# EAGLE schematic core (EAGLE 9.2.2)
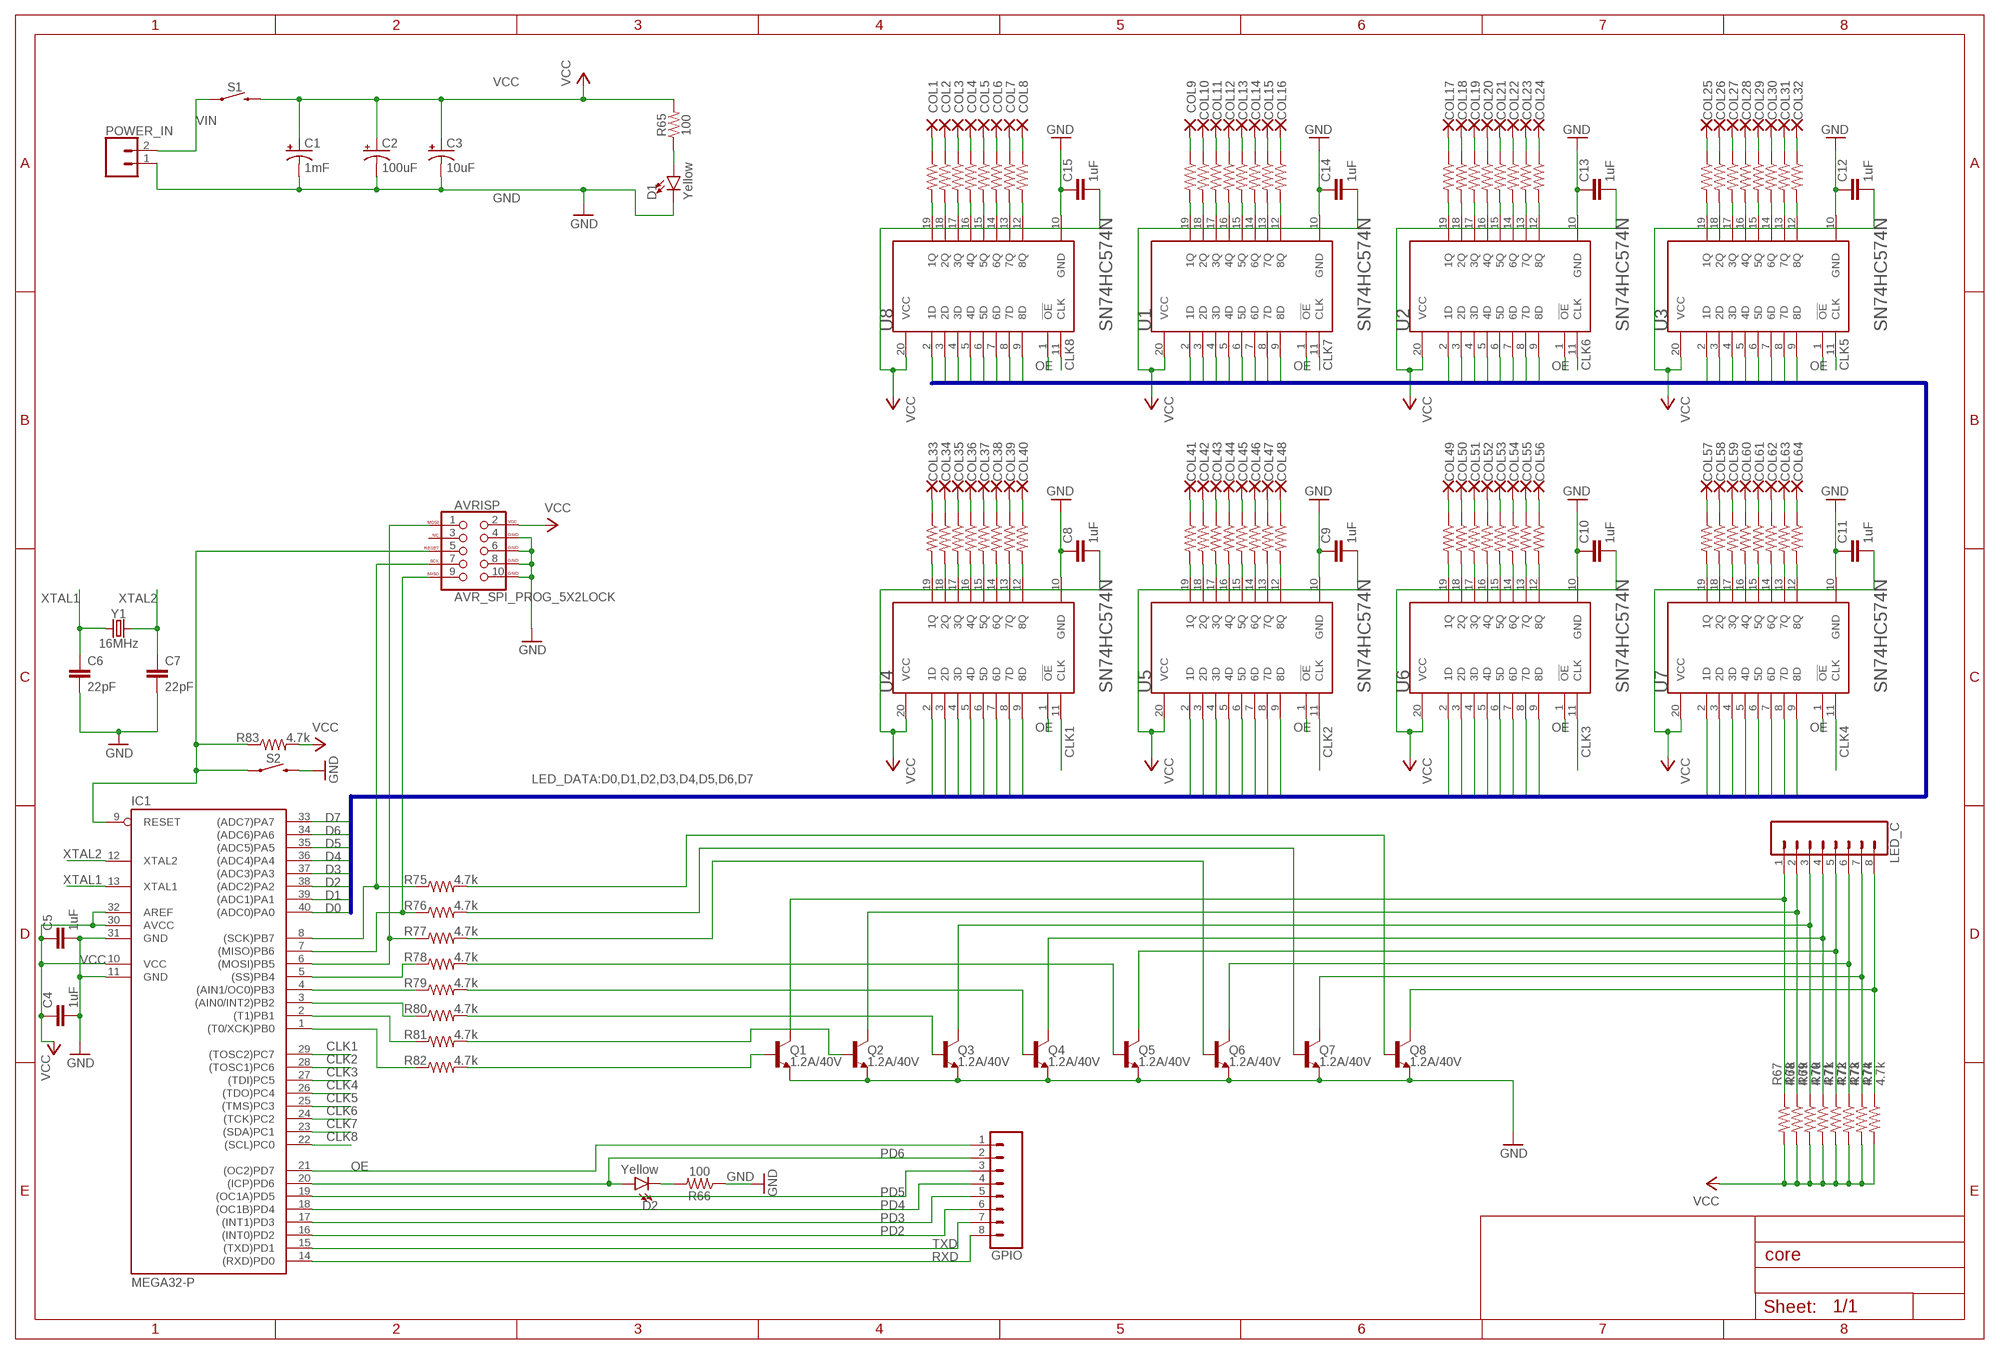
[diagram p0: schematic, sheet 1]

## Parts
AVRISP  AVR_SPI_PROG_5X2LOCK  [2X5-SHROUDED_LOCK]
C1  1mF  1000UF-RADIAL-5MM-25V-20%  [CPOL-RADIAL-5MM-10MM]
C2  100uF  100UF-POLAR-RADIAL-2.5MM-25V-20%  [CPOL-RADIAL-2.5MM-6.5MM]
C3  10uF  10UF-POLAR-RADIAL-2.5MM-25V-20%  [CPOL-RADIAL-2.5MM-5MM]
C4  1uF  C2,5-3  [C2.5-3]
C5  1uF  C2,5-3  [C2.5-3]
C6  22pF  22PF-PTH-2.54MM-200V-5%  [CAP-PTH-2.54]
C7  22pF  22PF-PTH-2.54MM-200V-5%  [CAP-PTH-2.54]
C8  1uF  C2,5-3  [C2.5-3]
C9  1uF  C2,5-3  [C2.5-3]
C10  1uF  C2,5-3  [C2.5-3]
C11  1uF  C2,5-3  [C2.5-3]
C12  1uF  C2,5-3  [C2.5-3]
C13  1uF  C2,5-3  [C2.5-3]
C14  1uF  C2,5-3  [C2.5-3]
C15  1uF  C2,5-3  [C2.5-3]
COL1  1,6/0,9  [1,6/0,9]
COL2  1,6/0,9  [1,6/0,9]
COL3  1,6/0,9  [1,6/0,9]
COL4  1,6/0,9  [1,6/0,9]
COL5  1,6/0,9  [1,6/0,9]
COL6  1,6/0,9  [1,6/0,9]
COL7  1,6/0,9  [1,6/0,9]
COL8  1,6/0,9  [1,6/0,9]
COL9  1,6/0,9  [1,6/0,9]
COL10  1,6/0,9  [1,6/0,9]
COL11  1,6/0,9  [1,6/0,9]
COL12  1,6/0,9  [1,6/0,9]
COL13  1,6/0,9  [1,6/0,9]
COL14  1,6/0,9  [1,6/0,9]
COL15  1,6/0,9  [1,6/0,9]
COL16  1,6/0,9  [1,6/0,9]
COL17  1,6/0,9  [1,6/0,9]
COL18  1,6/0,9  [1,6/0,9]
COL19  1,6/0,9  [1,6/0,9]
COL20  1,6/0,9  [1,6/0,9]
COL21  1,6/0,9  [1,6/0,9]
COL22  1,6/0,9  [1,6/0,9]
COL23  1,6/0,9  [1,6/0,9]
COL24  1,6/0,9  [1,6/0,9]
COL25  1,6/0,9  [1,6/0,9]
COL26  1,6/0,9  [1,6/0,9]
COL27  1,6/0,9  [1,6/0,9]
COL28  1,6/0,9  [1,6/0,9]
COL29  1,6/0,9  [1,6/0,9]
COL30  1,6/0,9  [1,6/0,9]
COL31  1,6/0,9  [1,6/0,9]
COL32  1,6/0,9  [1,6/0,9]
COL33  1,6/0,9  [1,6/0,9]
COL34  1,6/0,9  [1,6/0,9]
COL35  1,6/0,9  [1,6/0,9]
COL36  1,6/0,9  [1,6/0,9]
COL37  1,6/0,9  [1,6/0,9]
COL38  1,6/0,9  [1,6/0,9]
COL39  1,6/0,9  [1,6/0,9]
COL40  1,6/0,9  [1,6/0,9]
COL41  1,6/0,9  [1,6/0,9]
COL42  1,6/0,9  [1,6/0,9]
COL43  1,6/0,9  [1,6/0,9]
COL44  1,6/0,9  [1,6/0,9]
COL45  1,6/0,9  [1,6/0,9]
COL46  1,6/0,9  [1,6/0,9]
COL47  1,6/0,9  [1,6/0,9]
COL48  1,6/0,9  [1,6/0,9]
COL49  1,6/0,9  [1,6/0,9]
COL50  1,6/0,9  [1,6/0,9]
COL51  1,6/0,9  [1,6/0,9]
COL52  1,6/0,9  [1,6/0,9]
COL53  1,6/0,9  [1,6/0,9]
COL54  1,6/0,9  [1,6/0,9]
COL55  1,6/0,9  [1,6/0,9]
COL56  1,6/0,9  [1,6/0,9]
COL57  1,6/0,9  [1,6/0,9]
COL58  1,6/0,9  [1,6/0,9]
COL59  1,6/0,9  [1,6/0,9]
COL60  1,6/0,9  [1,6/0,9]
COL61  1,6/0,9  [1,6/0,9]
COL62  1,6/0,9  [1,6/0,9]
COL63  1,6/0,9  [1,6/0,9]
COL64  1,6/0,9  [1,6/0,9]
D1  Yellow  LED-YELLOWLILYPAD  [LED-1206]
D2  Yellow  LED-YELLOWLILYPAD  [LED-1206]
GPIO  CONN_08"  [1X08]
IC1  MEGA32-P  [DIL40]
LED_C  CONN_08"  [1X08]
POWER_IN  CONN_02POLAR  [MOLEX-1X2]
Q1  1.2A/40V  TRANS_NPN-MMBT2222AL  [SOT23-3]
Q2  1.2A/40V  TRANS_NPN-MMBT2222AL  [SOT23-3]
Q3  1.2A/40V  TRANS_NPN-MMBT2222AL  [SOT23-3]
Q4  1.2A/40V  TRANS_NPN-MMBT2222AL  [SOT23-3]
Q5  1.2A/40V  TRANS_NPN-MMBT2222AL  [SOT23-3]
Q6  1.2A/40V  TRANS_NPN-MMBT2222AL  [SOT23-3]
Q7  1.2A/40V  TRANS_NPN-MMBT2222AL  [SOT23-3]
Q8  1.2A/40V  TRANS_NPN-MMBT2222AL  [SOT23-3]
R1  100  100OHM-HORIZ-1/4W-1%  [AXIAL-0.3]
R2  100  100OHM-HORIZ-1/4W-1%  [AXIAL-0.3]
R3  100  100OHM-HORIZ-1/4W-1%  [AXIAL-0.3]
R4  100  100OHM-HORIZ-1/4W-1%  [AXIAL-0.3]
R5  100  100OHM-HORIZ-1/4W-1%  [AXIAL-0.3]
R6  100  100OHM-HORIZ-1/4W-1%  [AXIAL-0.3]
R7  100  100OHM-HORIZ-1/4W-1%  [AXIAL-0.3]
R8  100  100OHM-HORIZ-1/4W-1%  [AXIAL-0.3]
R9  100  100OHM-HORIZ-1/4W-1%  [AXIAL-0.3]
R10  100  100OHM-HORIZ-1/4W-1%  [AXIAL-0.3]
R11  100  100OHM-HORIZ-1/4W-1%  [AXIAL-0.3]
R12  100  100OHM-HORIZ-1/4W-1%  [AXIAL-0.3]
R13  100  100OHM-HORIZ-1/4W-1%  [AXIAL-0.3]
R14  100  100OHM-HORIZ-1/4W-1%  [AXIAL-0.3]
R15  100  100OHM-HORIZ-1/4W-1%  [AXIAL-0.3]
R16  100  100OHM-HORIZ-1/4W-1%  [AXIAL-0.3]
R17  100  100OHM-HORIZ-1/4W-1%  [AXIAL-0.3]
R18  100  100OHM-HORIZ-1/4W-1%  [AXIAL-0.3]
R19  100  100OHM-HORIZ-1/4W-1%  [AXIAL-0.3]
R20  100  100OHM-HORIZ-1/4W-1%  [AXIAL-0.3]
R21  100  100OHM-HORIZ-1/4W-1%  [AXIAL-0.3]
R22  100  100OHM-HORIZ-1/4W-1%  [AXIAL-0.3]
R23  100  100OHM-HORIZ-1/4W-1%  [AXIAL-0.3]
R24  100  100OHM-HORIZ-1/4W-1%  [AXIAL-0.3]
R25  100  100OHM-HORIZ-1/4W-1%  [AXIAL-0.3]
R26  100  100OHM-HORIZ-1/4W-1%  [AXIAL-0.3]
R27  100  100OHM-HORIZ-1/4W-1%  [AXIAL-0.3]
R28  100  100OHM-HORIZ-1/4W-1%  [AXIAL-0.3]
R29  100  100OHM-HORIZ-1/4W-1%  [AXIAL-0.3]
R30  100  100OHM-HORIZ-1/4W-1%  [AXIAL-0.3]
R31  100  100OHM-HORIZ-1/4W-1%  [AXIAL-0.3]
R32  100  100OHM-HORIZ-1/4W-1%  [AXIAL-0.3]
R33  100  100OHM-HORIZ-1/4W-1%  [AXIAL-0.3]
R34  100  100OHM-HORIZ-1/4W-1%  [AXIAL-0.3]
R35  100  100OHM-HORIZ-1/4W-1%  [AXIAL-0.3]
R36  100  100OHM-HORIZ-1/4W-1%  [AXIAL-0.3]
R37  100  100OHM-HORIZ-1/4W-1%  [AXIAL-0.3]
R38  100  100OHM-HORIZ-1/4W-1%  [AXIAL-0.3]
R39  100  100OHM-HORIZ-1/4W-1%  [AXIAL-0.3]
R40  100  100OHM-HORIZ-1/4W-1%  [AXIAL-0.3]
R41  100  100OHM-HORIZ-1/4W-1%  [AXIAL-0.3]
R42  100  100OHM-HORIZ-1/4W-1%  [AXIAL-0.3]
R43  100  100OHM-HORIZ-1/4W-1%  [AXIAL-0.3]
R44  100  100OHM-HORIZ-1/4W-1%  [AXIAL-0.3]
R45  100  100OHM-HORIZ-1/4W-1%  [AXIAL-0.3]
R46  100  100OHM-HORIZ-1/4W-1%  [AXIAL-0.3]
R47  100  100OHM-HORIZ-1/4W-1%  [AXIAL-0.3]
R48  100  100OHM-HORIZ-1/4W-1%  [AXIAL-0.3]
R49  100  100OHM-HORIZ-1/4W-1%  [AXIAL-0.3]
R50  100  100OHM-HORIZ-1/4W-1%  [AXIAL-0.3]
R51  100  100OHM-HORIZ-1/4W-1%  [AXIAL-0.3]
R52  100  100OHM-HORIZ-1/4W-1%  [AXIAL-0.3]
R53  100  100OHM-HORIZ-1/4W-1%  [AXIAL-0.3]
R54  100  100OHM-HORIZ-1/4W-1%  [AXIAL-0.3]
R55  100  100OHM-HORIZ-1/4W-1%  [AXIAL-0.3]
R56  100  100OHM-HORIZ-1/4W-1%  [AXIAL-0.3]
R57  100  100OHM-HORIZ-1/4W-1%  [AXIAL-0.3]
R58  100  100OHM-HORIZ-1/4W-1%  [AXIAL-0.3]
R59  100  100OHM-HORIZ-1/4W-1%  [AXIAL-0.3]
R60  100  100OHM-HORIZ-1/4W-1%  [AXIAL-0.3]
R61  100  100OHM-HORIZ-1/4W-1%  [AXIAL-0.3]
R62  100  100OHM-HORIZ-1/4W-1%  [AXIAL-0.3]
R63  100  100OHM-HORIZ-1/4W-1%  [AXIAL-0.3]
R64  100  100OHM-HORIZ-1/4W-1%  [AXIAL-0.3]
R65  100  100OHM-HORIZ-1/4W-1%  [AXIAL-0.3]
R66  100  100OHM-HORIZ-1/4W-1%  [AXIAL-0.3]
R67  4.7k  1KOHM-HORIZ-1/4W-1%  [AXIAL-0.3]
R68  4.7k  1KOHM-HORIZ-1/4W-1%  [AXIAL-0.3]
R69  4.7k  1KOHM-HORIZ-1/4W-1%  [AXIAL-0.3]
R70  4.7k  1KOHM-HORIZ-1/4W-1%  [AXIAL-0.3]
R71  4.7k  1KOHM-HORIZ-1/4W-1%  [AXIAL-0.3]
R72  4.7k  1KOHM-HORIZ-1/4W-1%  [AXIAL-0.3]
R73  4.7k  1KOHM-HORIZ-1/4W-1%  [AXIAL-0.3]
R74  4.7k  1KOHM-HORIZ-1/4W-1%  [AXIAL-0.3]
R75  4.7k  1KOHM-HORIZ-1/4W-1%  [AXIAL-0.3]
R76  4.7k  1KOHM-HORIZ-1/4W-1%  [AXIAL-0.3]
R77  4.7k  1KOHM-HORIZ-1/4W-1%  [AXIAL-0.3]
R78  4.7k  1KOHM-HORIZ-1/4W-1%  [AXIAL-0.3]
R79  4.7k  1KOHM-HORIZ-1/4W-1%  [AXIAL-0.3]
R80  4.7k  1KOHM-HORIZ-1/4W-1%  [AXIAL-0.3]
R81  4.7k  1KOHM-HORIZ-1/4W-1%  [AXIAL-0.3]
R82  4.7k  1KOHM-HORIZ-1/4W-1%  [AXIAL-0.3]
R83  4.7k  1KOHM-HORIZ-1/4W-1%  [AXIAL-0.3]
S1  MOMENTARY-SWITCH-SPST-PTH-RIGHT-ANGLE-KIT  [TACTILE_SWITCH_PTH_RIGHT_ANGLE_KIT]
S2  MOMENTARY-SWITCH-SPST-PTH-6.0MM  [TACTILE_SWITCH_PTH_6.0MM]
U1  TEXAS_INSTRUMENTS_SN74HC574NTEXAS_INSTRUMENTS_SN74HC574N_0_0  [TEXAS_INSTRUMENTS_SN74HC574N_0]
U2  TEXAS_INSTRUMENTS_SN74HC574NTEXAS_INSTRUMENTS_SN74HC574N_0_0  [TEXAS_INSTRUMENTS_SN74HC574N_0]
U3  TEXAS_INSTRUMENTS_SN74HC574NTEXAS_INSTRUMENTS_SN74HC574N_0_0  [TEXAS_INSTRUMENTS_SN74HC574N_0]
U4  TEXAS_INSTRUMENTS_SN74HC574NTEXAS_INSTRUMENTS_SN74HC574N_0_0  [TEXAS_INSTRUMENTS_SN74HC574N_0]
U5  TEXAS_INSTRUMENTS_SN74HC574NTEXAS_INSTRUMENTS_SN74HC574N_0_0  [TEXAS_INSTRUMENTS_SN74HC574N_0]
U6  TEXAS_INSTRUMENTS_SN74HC574NTEXAS_INSTRUMENTS_SN74HC574N_0_0  [TEXAS_INSTRUMENTS_SN74HC574N_0]
U7  TEXAS_INSTRUMENTS_SN74HC574NTEXAS_INSTRUMENTS_SN74HC574N_0_0  [TEXAS_INSTRUMENTS_SN74HC574N_0]
U8  TEXAS_INSTRUMENTS_SN74HC574NTEXAS_INSTRUMENTS_SN74HC574N_0_0  [TEXAS_INSTRUMENTS_SN74HC574N_0]
Y1  16MHz  CRYSTAL-16MHZPTH-HC49US  [HC49US]

## Nets
CLK1: IC1.29((TOSC2)PC7) U4.11(CLK)
CLK2: IC1.28((TOSC1)PC6) U5.11(CLK)
CLK3: IC1.27((TDI)PC5) U6.11(CLK)
CLK4: IC1.26((TDO)PC4) U7.11(CLK)
CLK5: IC1.25((TMS)PC3) U3.11(CLK)
CLK6: IC1.24((TCK)PC2) U2.11(CLK)
CLK7: IC1.23((SDA)PC1) U1.11(CLK)
CLK8: IC1.22((SCL)PC0) U8.11(CLK)
D0: IC1.40((ADC0)PA0) U1.2(1D) U2.2(1D) U3.2(1D) U4.2(1D) U5.2(1D) U6.2(1D) U7.2(1D) U8.2(1D)
D1: IC1.39((ADC1)PA1) U1.3(2D) U2.3(2D) U3.3(2D) U4.3(2D) U5.3(2D) U6.3(2D) U7.3(2D) U8.3(2D)
D2: IC1.38((ADC2)PA2) U1.4(3D) U2.4(3D) U3.4(3D) U4.4(3D) U5.4(3D) U6.4(3D) U7.4(3D) U8.4(3D)
D3: IC1.37((ADC3)PA3) U1.5(4D) U2.5(4D) U3.5(4D) U4.5(4D) U5.5(4D) U6.5(4D) U7.5(4D) U8.5(4D)
D4: IC1.36((ADC4)PA4) U1.6(5D) U2.6(5D) U3.6(5D) U4.6(5D) U5.6(5D) U6.6(5D) U7.6(5D) U8.6(5D)
D5: IC1.35((ADC5)PA5) U1.7(6D) U2.7(6D) U3.7(6D) U4.7(6D) U5.7(6D) U6.7(6D) U7.7(6D) U8.7(6D)
D6: IC1.34((ADC6)PA6) U1.8(7D) U2.8(7D) U3.8(7D) U4.8(7D) U5.8(7D) U6.8(7D) U7.8(7D) U8.8(7D)
D7: IC1.33((ADC7)PA7) U1.9(8D) U2.9(8D) U3.9(8D) U4.9(8D) U5.9(8D) U6.9(8D) U7.9(8D) U8.9(8D)
GND: AVRISP.4(GND) AVRISP.6(GND) AVRISP.8(GND) AVRISP.10(GND) C1.- C2.2(-) C3.2(-) C4.2 C5.2 C6.2 C7.2 C8.1 C9.1 C10.1 C11.1 C12.1 C13.1 C14.1 C15.1 D1.C IC1.11(GND) IC1.31(GND) POWER_IN.1 Q1.2(E) Q2.2(E) Q3.2(E) Q4.2(E) Q5.2(E) Q6.2(E) Q7.2(E) Q8.2(E) R66.P$1 S2.3 U1.10(GND) U2.10(GND) U3.10(GND) U4.10(GND) U5.10(GND) U6.10(GND) U7.10(GND) U8.10(GND)
N$2: COL1.1(P) R1.P$1
N$3: R1.P$2 U8.19(1Q)
N$4: COL2.1(P) R2.P$1
N$5: R2.P$2 U8.18(2Q)
N$6: COL3.1(P) R3.P$1
N$7: R3.P$2 U8.17(3Q)
N$8: COL4.1(P) R4.P$1
N$9: R4.P$2 U8.16(4Q)
N$10: COL5.1(P) R5.P$1
N$11: R5.P$2 U8.15(5Q)
N$12: COL6.1(P) R6.P$1
N$13: R6.P$2 U8.14(6Q)
N$14: COL7.1(P) R7.P$1
N$15: R7.P$2 U8.13(7Q)
N$16: COL8.1(P) R8.P$1
N$17: R8.P$2 U8.12(8Q)
N$18: COL9.1(P) R9.P$1
N$19: R9.P$2 U1.19(1Q)
N$20: COL10.1(P) R10.P$1
N$21: R10.P$2 U1.18(2Q)
N$22: COL11.1(P) R11.P$1
N$23: R11.P$2 U1.17(3Q)
N$24: COL12.1(P) R12.P$1
N$25: R12.P$2 U1.16(4Q)
N$26: COL13.1(P) R13.P$1
N$27: R13.P$2 U1.15(5Q)
N$28: COL14.1(P) R14.P$1
N$29: R14.P$2 U1.14(6Q)
N$30: COL15.1(P) R15.P$1
N$31: R15.P$2 U1.13(7Q)
N$32: COL16.1(P) R16.P$1
N$33: R16.P$2 U1.12(8Q)
N$34: COL17.1(P) R17.P$1
N$35: R17.P$2 U2.19(1Q)
N$36: COL18.1(P) R18.P$1
N$37: R18.P$2 U2.18(2Q)
N$38: COL19.1(P) R19.P$1
N$39: R19.P$2 U2.17(3Q)
N$40: COL20.1(P) R20.P$1
N$41: R20.P$2 U2.16(4Q)
N$42: COL21.1(P) R21.P$1
N$43: R21.P$2 U2.15(5Q)
N$44: COL22.1(P) R22.P$1
N$45: R22.P$2 U2.14(6Q)
N$46: COL23.1(P) R23.P$1
N$47: R23.P$2 U2.13(7Q)
N$48: COL24.1(P) R24.P$1
N$49: R24.P$2 U2.12(8Q)
N$50: COL25.1(P) R25.P$1
N$51: R25.P$2 U3.19(1Q)
N$52: COL26.1(P) R26.P$1
N$53: R26.P$2 U3.18(2Q)
N$54: COL27.1(P) R27.P$1
N$55: R27.P$2 U3.17(3Q)
N$56: COL28.1(P) R28.P$1
N$57: R28.P$2 U3.16(4Q)
N$58: COL29.1(P) R29.P$1
N$59: R29.P$2 U3.15(5Q)
N$60: COL30.1(P) R30.P$1
N$61: R30.P$2 U3.14(6Q)
N$62: COL31.1(P) R31.P$1
N$63: R31.P$2 U3.13(7Q)
N$64: COL32.1(P) R32.P$1
N$65: R32.P$2 U3.12(8Q)
N$66: COL33.1(P) R33.P$1
N$67: R33.P$2 U4.19(1Q)
N$68: COL34.1(P) R34.P$1
N$69: R34.P$2 U4.18(2Q)
N$70: COL35.1(P) R35.P$1
N$71: R35.P$2 U4.17(3Q)
N$72: COL36.1(P) R36.P$1
N$73: R36.P$2 U4.16(4Q)
N$74: COL37.1(P) R37.P$1
N$75: R37.P$2 U4.15(5Q)
N$76: COL38.1(P) R38.P$1
N$77: R38.P$2 U4.14(6Q)
N$78: COL39.1(P) R39.P$1
N$79: R39.P$2 U4.13(7Q)
N$80: COL40.1(P) R40.P$1
N$81: R40.P$2 U4.12(8Q)
N$82: COL41.1(P) R41.P$1
N$83: R41.P$2 U5.19(1Q)
N$84: COL42.1(P) R42.P$1
N$85: R42.P$2 U5.18(2Q)
N$86: COL43.1(P) R43.P$1
N$87: R43.P$2 U5.17(3Q)
N$88: COL44.1(P) R44.P$1
N$89: R44.P$2 U5.16(4Q)
N$90: COL45.1(P) R45.P$1
N$91: R45.P$2 U5.15(5Q)
N$92: COL46.1(P) R46.P$1
N$93: R46.P$2 U5.14(6Q)
N$94: COL47.1(P) R47.P$1
N$95: R47.P$2 U5.13(7Q)
N$96: COL48.1(P) R48.P$1
N$97: R48.P$2 U5.12(8Q)
N$98: COL49.1(P) R49.P$1
N$99: R49.P$2 U6.19(1Q)
N$100: COL50.1(P) R50.P$1
N$101: R50.P$2 U6.18(2Q)
N$102: COL51.1(P) R51.P$1
N$103: R51.P$2 U6.17(3Q)
N$104: COL52.1(P) R52.P$1
N$105: R52.P$2 U6.16(4Q)
N$106: COL53.1(P) R53.P$1
N$107: R53.P$2 U6.15(5Q)
N$108: COL54.1(P) R54.P$1
N$109: R54.P$2 U6.14(6Q)
N$110: COL55.1(P) R55.P$1
N$111: R55.P$2 U6.13(7Q)
N$112: COL56.1(P) R56.P$1
N$113: R56.P$2 U6.12(8Q)
N$114: COL57.1(P) R57.P$1
N$115: R57.P$2 U7.19(1Q)
N$116: COL58.1(P) R58.P$1
N$117: R58.P$2 U7.18(2Q)
N$118: COL59.1(P) R59.P$1
N$119: R59.P$2 U7.17(3Q)
N$120: COL60.1(P) R60.P$1
N$121: R60.P$2 U7.16(4Q)
N$122: COL61.1(P) R61.P$1
N$123: R61.P$2 U7.15(5Q)
N$124: COL62.1(P) R62.P$1
N$125: R62.P$2 U7.14(6Q)
N$126: COL63.1(P) R63.P$1
N$127: R63.P$2 U7.13(7Q)
N$128: COL64.1(P) R64.P$1
N$129: R64.P$2 U7.12(8Q)
N$131: D1.A R65.P$1
N$132: D2.C R66.P$2
N$133: LED_C.1 Q1.3(C) R67.P$1
N$134: LED_C.2 Q2.3(C) R68.P$1
N$135: LED_C.3 Q3.3(C) R69.P$1
N$136: LED_C.4 Q4.3(C) R70.P$1
N$137: LED_C.5 Q5.3(C) R71.P$1
N$138: LED_C.6 Q6.3(C) R72.P$1
N$139: LED_C.7 Q7.3(C) R73.P$1
N$140: LED_C.8 Q8.3(C) R74.P$1
N$141: IC1.1((T0/XCK)PB0) R82.P$1
N$142: IC1.2((T1)PB1) R81.P$1
N$143: IC1.3((AIN0/INT2)PB2) R80.P$1
N$144: IC1.4((AIN1/OC0)PB3) R79.P$1
N$145: IC1.5((SS)PB4) R78.P$1
N$146: AVRISP.1(MOSI) IC1.6((MOSI)PB5) R77.P$1
N$147: AVRISP.9(MISO) IC1.7((MISO)PB6) R76.P$1
N$148: AVRISP.7(SCK) IC1.8((SCK)PB7) R75.P$1
N$149: Q1.1(B) R82.P$2
N$150: Q2.1(B) R81.P$2
N$151: Q6.1(B) R77.P$2
N$152: Q3.1(B) R80.P$2
N$153: Q4.1(B) R79.P$2
N$154: Q5.1(B) R78.P$2
N$155: Q7.1(B) R76.P$2
N$156: Q8.1(B) R75.P$2
N$157: AVRISP.5(RESET) IC1.9(RESET) R83.P$1 S2.1
OE: GPIO.1 IC1.21((OC2)PD7) U1.1(!OE!) U2.1(!OE!) U3.1(!OE!) U4.1(!OE!) U5.1(!OE!) U6.1(!OE!) U7.1(!OE!) U8.1(!OE!)
PD2: GPIO.6 IC1.16((INT0)PD2)
PD3: GPIO.5 IC1.17((INT1)PD3)
PD4: GPIO.4 IC1.18((OC1B)PD4)
PD5: GPIO.3 IC1.19((OC1A)PD5)
PD6: D2.A GPIO.2 IC1.20((ICP)PD6)
RXD: GPIO.8 IC1.14((RXD)PD0)
TXD: GPIO.7 IC1.15((TXD)PD1)
VCC: AVRISP.2(VCC) C1.+ C2.1(+) C3.1(+) C4.1 C5.1 C8.2 C9.2 C10.2 C11.2 C12.2 C13.2 C14.2 C15.2 IC1.10(VCC) IC1.30(AVCC) IC1.32(AREF) R65.P$2 R67.P$2 R68.P$2 R69.P$2 R70.P$2 R71.P$2 R72.P$2 R73.P$2 R74.P$2 R83.P$2 S1.2 U1.20(VCC) U2.20(VCC) U3.20(VCC) U4.20(VCC) U5.20(VCC) U6.20(VCC) U7.20(VCC) U8.20(VCC)
VIN: POWER_IN.2 S1.1
XTAL1: C6.1 IC1.13(XTAL1) Y1.1
XTAL2: C7.1 IC1.12(XTAL2) Y1.2
Unconnected: AVRISP.3(NC)

## Buses
LED_DATA:D0,D1,D2,D3,D4,D5,D6,D7

## Library data of the parts
AVRISP = SparkFun-Connectors:AVR_SPI_PROG_5X2: AVR 10-pin ICSP Header This is the standard AVR In Circuit Serial Programming header. Minimal, but includes pin one indicator. Works with standard Olimex programmers. SparkFun Products: 2x5 AVR ICSP Male Header <https://www.sparkfun.com/products/778> - PTH 2x5 Pin Shrouded Header <https://www.sparkfun.com/products/8506> - PTH2; PROD_ID: CONN-08671; SF_ID: PRT-08506
C1 = SparkFun-Capacitors:1000UF: 1,000µF/1mF ceramic capacitors A capacitor is a passive two-terminal electrical component used to store electrical energy temporarily in an electric field. CAP-08070; PROD_ID: CAP-09538
C2 = SparkFun-Capacitors:100UF-POLAR: 100µF polarized capacitors A capacitor is a passive two-terminal electrical component used to store electrical energy temporarily in an electric field.; PROD_ID: CAP-08439
C3 = SparkFun-Capacitors:10UF-POLAR: 10.0µF polarized capacitors A capacitor is a passive two-terminal electrical component used to store electrical energy temporarily in an electric field.; PROD_ID: CAP-08440
C4 C5 C8-C15 = capacitor-wima:C: CAPACITOR naming: grid - package width
C6 C7 = SparkFun-Capacitors:22PF: 22pF ceramic capacitors A capacitor is a passive two-terminal electrical component used to store electrical energy temporarily in an electric field.; PROD_ID: CAP-09128
COL1-COL64 = wirepad:1,6/0,9: THROUGH-HOLE PAD
D1 D2 = SparkFun-LED:LED-YELLOW: Yellow SMD LED Used in manufacturing several products at SparkFun. Packages: 0603 - SMD 0603 package[Product Link] <http://www.kingbrightusa.com/product.asp?catalog_name=LED&product_id=APT1608SYCK> 0603 -SMART - SMART SMD 0603 package (more efficient/more expensive) [Product Link] <http://www.osram-os.com/osram_os/en/products/product-catalog/led-light-emitting-diodes/smartled-0603/ly-l29k/index.jsp> LilyPad - SMD1206 package[Product Datasheet] <https://www.sparkfun.com/datasheets/DevTools/LilyPad/Q150YUS4.pdf> SparkFun Products: Blynk Board <https://www.sparkfun.com/products/13794> IOIO-OTG <https://www.sparkfun.com/products/13613> XBee Explorer Serial <https://www.sparkfun.com/products/13225>; PROD_ID: DIO-09909
GPIO LED_C = SparkFun-Connectors:CONN_08: Multi connection point. Often used as Generic Header-pin footprint for 0.1 inch spaced/style header connections On any of the 0.1 inch spaced packages, you can populate with these: Break Away Headers - Straight <https://www.sparkfun.com/products/116> (PRT-00116) Break Away Male Headers - Right Angle <https://www.sparkfun.com/products/553> (PRT-00553) Female Headers <https://www.sparkfun.com/products/115> (PRT-00115) Break Away Headers - Machine Pin <https://www.sparkfun.com/products/117> (PRT-00117) Break Away Female Headers - Swiss Machine Pin <https://www.sparkfun.com/products/743> (PRT-00743) Arduino Stackable Header - 8 Pin <https://www.sparkfun.com/products/9279> (PRT-09279) For SCREWTERMINALS and SPRING TERMINALS visit here: Screw Terimnals on SparkFun.com <https://www.sparkfun.com/search/results?term=Screw+Terminals> (5mm/3.5mm/2.54mm spacing) This device is also useful as a general connection point to wire up your design to another part of your project. Our various solder wires solder well into these plated through hole pads. Hook-Up Wire - Assortment (Stranded, 22 AWG) <https://www.sparkfun.com/products/11375> (PRT-11375) Hook-Up Wire - Assortment (Solid Core, 22 AWG) <https://www.sparkfun.com/products/11367> (PRT-11367) View the entire wire category on our website here <https://www.sparkfun.com/categories/141> Special notes: Molex polarized connector foot print use with SKU : PRT-08231 with associated crimp pins and housings. 1MM SMD Version SKU: PRT-10208 NOTES ON THE VARIANTS LOCK and LOCK_LONGPADS... This footprint was designed to help hold the alignment of a through-hole component (i.e. 6-pin header) while soldering it into place. You may notice that each hole has been shifted either up or down by 0.005 of an inch from it's more standard position (which is a perfectly straight line). This slight alteration caused the pins (the squares in the middle) to touch the edges of the holes. Because they are alternating, it causes a "brace" to hold the component in place. 0.005 has proven to be the perfect amount of "off-center" position when using our standard breakaway headers. Although looks a little odd when you look at the bare footprint, once you have a header in there, the alteration is very hard to notice. Also,if you push a header all the way into place, it is covered up entirely on the bottom side.; PROD_ID: CONN-08438
IC1 = atmel:MEGA32-P: MICROCONTROLLER 32 Kbytes FLASH 2 Kbytes SRAM 1 Kbytes EEPROM USART 8-channel 10 bit ADC Source: www.atmel.com .. doc2503.pdf; MPN: ATMEGA32-16PU; OC_FARNELL: 1661729; OC_NEWARK: 51P1794
POWER_IN = SparkFun-Connectors:CONN_02: Multi connection point. Often used as Generic Header-pin footprint for 0.1 inch spaced/style header connections On any of the 0.1 inch spaced packages, you can populate with these: Break Away Headers - Straight <https://www.sparkfun.com/products/116> (PRT-00116) Break Away Male Headers - Right Angle <https://www.sparkfun.com/products/553> (PRT-00553) Female Headers <https://www.sparkfun.com/products/115> (PRT-00115) Break Away Headers - Machine Pin <https://www.sparkfun.com/products/117> (PRT-00117) Break Away Female Headers - Swiss Machine Pin <https://www.sparkfun.com/products/743> (PRT-00743) For SCREWTERMINALS and SPRING TERMINALS visit here: Screw Terimnals on SparkFun.com <https://www.sparkfun.com/search/results?term=Screw+Terminals> (5mm/3.5mm/2.54mm spacing) This device is also useful as a general connection point to wire up your design to another part of your project. Our various solder wires solder well into these plated through hole pads. Hook-Up Wire - Assortment (Stranded, 22 AWG) <https://www.sparkfun.com/products/11375> (PRT-11375) Hook-Up Wire - Assortment (Solid Core, 22 AWG) <https://www.sparkfun.com/products/11367> (PRT-11367) View the entire wire category on our website here <https://www.sparkfun.com/categories/141> Special notes: Molex polarized connector foot print use with: PRT-08233 with associated crimp pins and housings. 2.54_SCREWTERM for use with PRT-10571. 3.5mm Screw Terminal footprints for PRT-08084 5mm Screw Terminal footprints for use with PRT-08432; SF_ID: PRT-09918
Q1-Q8 = SparkFun-DiscreteSemi:TRANS_NPN: NPN transistor Current controlled devices typically used to amplify current or used as a switch. BC547 - COM-08928 <http://www.sparkfun.com/products/8928> (TO-92 45V 100mA) (1.Collector 2.Base 3.Emitter) 2N3904 - COM-00521 <http://www.sparkfun.com/products/521> (TO-92 40V 200mA) (1.Emitter 2.Base 3.Collector) P2N2222A - COM-12852 <http://www.sparkfun.com/products/12852> (TO-92 40V 600mA) (1.Collector 2.Base 3.Emitter); PROD_ID: TRANS-08049; VALUE: 600mA/40V
R1-R66 = SparkFun-Resistors:100OHM: 100Ω resistor A resistor is a passive two-terminal electrical component that implements electrical resistance as a circuit element. Resistors act to reduce current flow, and, at the same time, act to lower voltage levels within circuits. - Wikipedia; PROD_ID: RES-12181
R67-R83 = SparkFun-Resistors:1KOHM: 1kΩ resistor A resistor is a passive two-terminal electrical component that implements electrical resistance as a circuit element. Resistors act to reduce current flow, and, at the same time, act to lower voltage levels within circuits. - Wikipedia; PROD_ID: RES-12182; VALUE: 1k
S1 = SparkFun-Switches:MOMENTARY-SWITCH-SPST: Momentary Switch (Pushbutton) - SPST Normally-open (NO) SPST momentary switches (buttons, pushbuttons). Variants PTH-12MM - 12mm square, through-hole Momentary Pushbutton Switch - 12mm Square <https://www.sparkfun.com/products/9190> (COM-09190) PTH-6.0MM, PTH-6.0MM-KIT - 6.0mm square, through-hole Mini Pushbutton Switch <https://www.sparkfun.com/products/97> (COM-00097) KIT package intended for soldering kit's - only one side of pads' copper is exposed. PTH-RIGHT-ANGLE-KIT - Right-angle, through-hole Right Angle Tactile Button <https://www.sparkfun.com/products/10791> - Used on SparkFun BigTime Watch Kit <https://www.sparkfun.com/products/11734> SMD-12MM - 12mm square, surface-mount Tactile Button - SMD (12mm) <https://www.sparkfun.com/products/12993> (COM-12993) Used on SparkFun PicoBoard <https://www.sparkfun.com/products/11888> SMD-4.5MM - 4.5mm Square Trackball Switch Used on SparkFun Blackberry Trackballer Breakout <https://www.sparkfun.com/products/13169> SMD-4.6MMX2.8MM - 4.60mm x 2.80mm, surface mount Used on SparkFun SAMD21 Mini Breakout <https://www.sparkfun.com/products/13664> SMD-5.2MM, SMD-5.2-REDUNDANT - 5.2mm square, surface-mount Mini Pushbutton Switch - SMD <https://www.sparkfun.com/products/8720> (COM-08720) Used on Arduino Pro Mini <https://www.sparkfun.com/products/11114> REDUNDANT package connects both switch circuits together SMD-6.0X3.5MM - 6.0 x 3.5mm, surface mount Momentary Reset Switch SMD <https://www.sparkfun.com/products/8229> (COM-08229) SMD-6.2MM-TALL - 6.2mm square, surface mount Tactile Button - SMD (6mm) <https://www.sparkfun.com/products/12992> Used on SparkFun Digital Sandbox <https://www.sparkfun.com/products/12651> SMD-RIGHT-ANGLE - Right-angle, surface mount Used on SparkFun Block for Intel® Edison - Arduino <https://www.sparkfun.com/products/13036>; PROD_ID: CONN-10672; SF_SKU: COM-10791
S2 = SparkFun-Switches:MOMENTARY-SWITCH-SPST: Momentary Switch (Pushbutton) - SPST Normally-open (NO) SPST momentary switches (buttons, pushbuttons). Variants PTH-12MM - 12mm square, through-hole Momentary Pushbutton Switch - 12mm Square <https://www.sparkfun.com/products/9190> (COM-09190) PTH-6.0MM, PTH-6.0MM-KIT - 6.0mm square, through-hole Mini Pushbutton Switch <https://www.sparkfun.com/products/97> (COM-00097) KIT package intended for soldering kit's - only one side of pads' copper is exposed. PTH-RIGHT-ANGLE-KIT - Right-angle, through-hole Right Angle Tactile Button <https://www.sparkfun.com/products/10791> - Used on SparkFun BigTime Watch Kit <https://www.sparkfun.com/products/11734> SMD-12MM - 12mm square, surface-mount Tactile Button - SMD (12mm) <https://www.sparkfun.com/products/12993> (COM-12993) Used on SparkFun PicoBoard <https://www.sparkfun.com/products/11888> SMD-4.5MM - 4.5mm Square Trackball Switch Used on SparkFun Blackberry Trackballer Breakout <https://www.sparkfun.com/products/13169> SMD-4.6MMX2.8MM - 4.60mm x 2.80mm, surface mount Used on SparkFun SAMD21 Mini Breakout <https://www.sparkfun.com/products/13664> SMD-5.2MM, SMD-5.2-REDUNDANT - 5.2mm square, surface-mount Mini Pushbutton Switch - SMD <https://www.sparkfun.com/products/8720> (COM-08720) Used on Arduino Pro Mini <https://www.sparkfun.com/products/11114> REDUNDANT package connects both switch circuits together SMD-6.0X3.5MM - 6.0 x 3.5mm, surface mount Momentary Reset Switch SMD <https://www.sparkfun.com/products/8229> (COM-08229) SMD-6.2MM-TALL - 6.2mm square, surface mount Tactile Button - SMD (6mm) <https://www.sparkfun.com/products/12992> Used on SparkFun Digital Sandbox <https://www.sparkfun.com/products/12651> SMD-RIGHT-ANGLE - Right-angle, surface mount Used on SparkFun Block for Intel® Edison - Arduino <https://www.sparkfun.com/products/13036>; PROD_ID: SWCH-08441; SF_SKU: COM-00097
U1-U8 = Texas Instruments - SN74HC574N:TEXAS_INSTRUMENTS_SN74HC574N: OCTAL EDGE-TRIGGERED D-TYPE FLIP-FLOPS WITH 3-STATE OUTPUTS; CENTROID_NOT_SPECIFIED: No; DATASHEET: http://www.ti.com/lit/ds/symlink/sn74hc574.pdf; DIGIKEY_DESCRIPTION: IC D-TYPE POS TRG SNGL 20DIP; DIGIKEY_PART_NUMBER: 296-1598-5-ND; IPC_LAND_PATTERN_NAME: DIP794W46P254L2540H508Q20; LEAD_FREE: yes; MF: Texas Instruments; MFG_PACKAGE_IDENT: N (R-PDIP-T20); MOUSER_PART_NUMBER: 595-SN74HC574N; MPN: SN74HC574N; NUMBER_OF_BITS_PER_ELEMENT: 8; NUMBER_OF_ELEMENTS: 1; OUTPUT_TYPE: Tri-State, Non-Inverted; PACKAGE: DIP-20; PREFIX: U; ROHS: yes; TEMPERATURE_RANGE_HIGH: +85°C; TEMPERATURE_RANGE_LOW: -40°C; TYPE: D-Type; VOLTAGE: 2V~6V
Y1 = SparkFun-Clocks:CRYSTAL-16MHZ: 16MHz Crystal Digikey Example <http://www.digikey.com/product-search/en?keywords=535-9122-1-ND> Frequency: 16MHz Frequency Stability: ±50ppm Frequency Tolerance: ±20ppm Load Capacitance: 18pF SparkFun Products: Pro Micro -5V/16MHz <https://www.sparkfun.com/products/12640> SparkFun Serial Enabled LCD Kit <https://www.sparkfun.com/products/10097>; PROD_ID: XTAL-08181; SF_ID: COM-00536